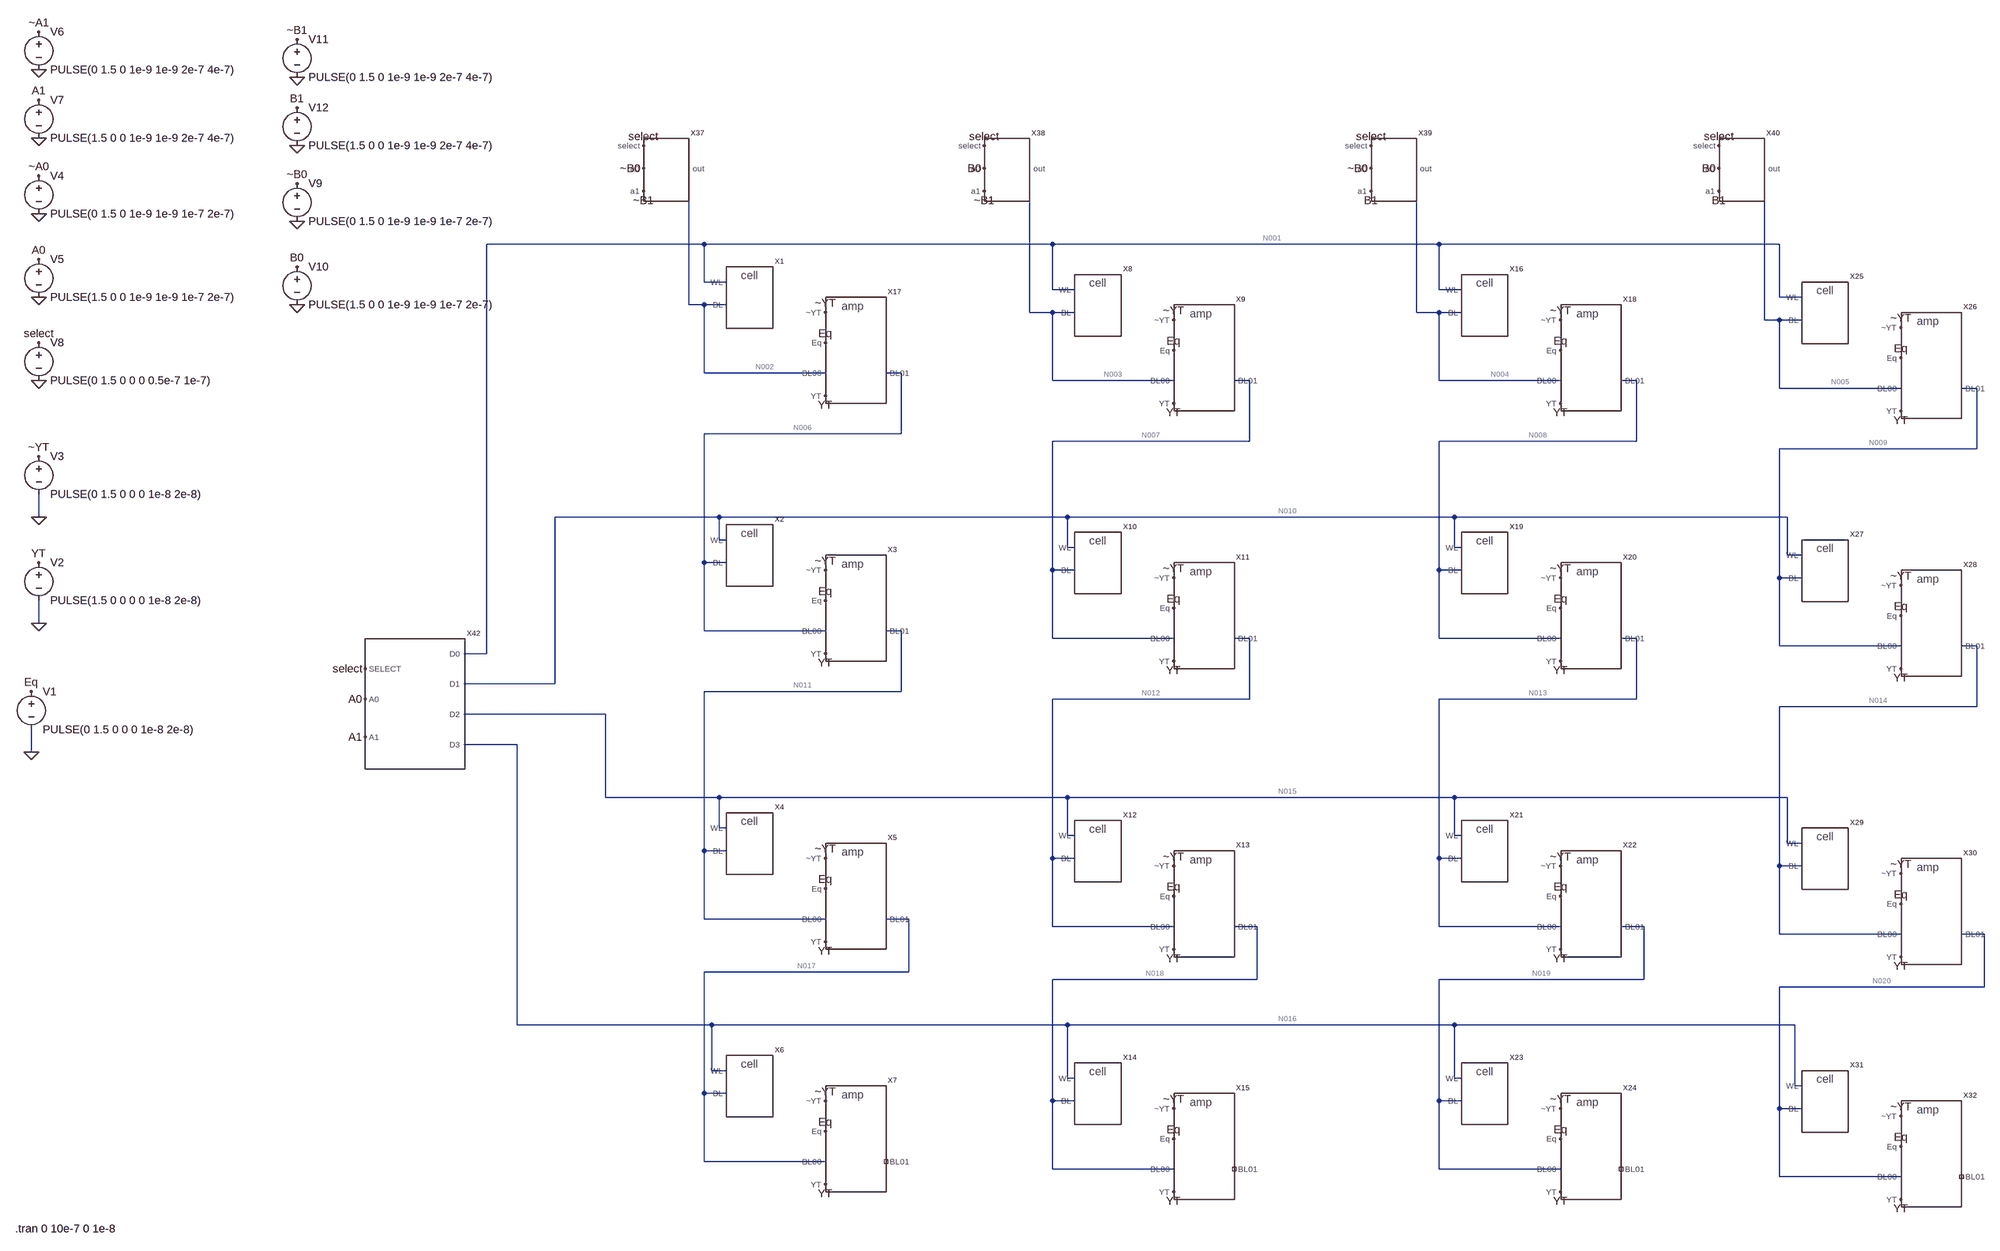
[diagram p0: schematic Memory.asc]
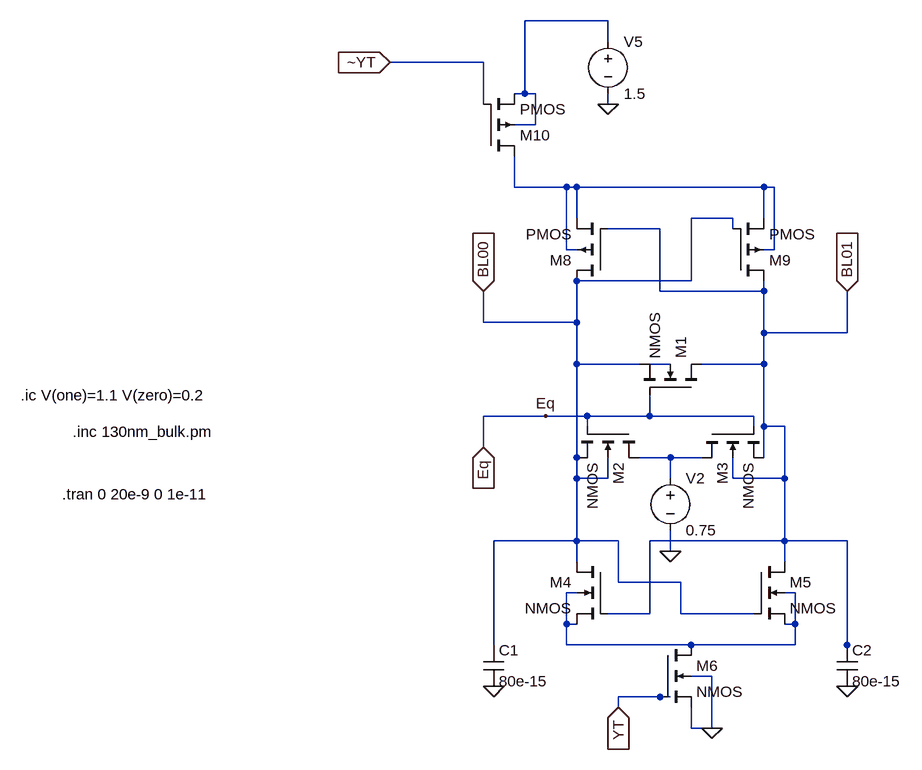
[diagram p1: sub-circuit amplifaer.asc]
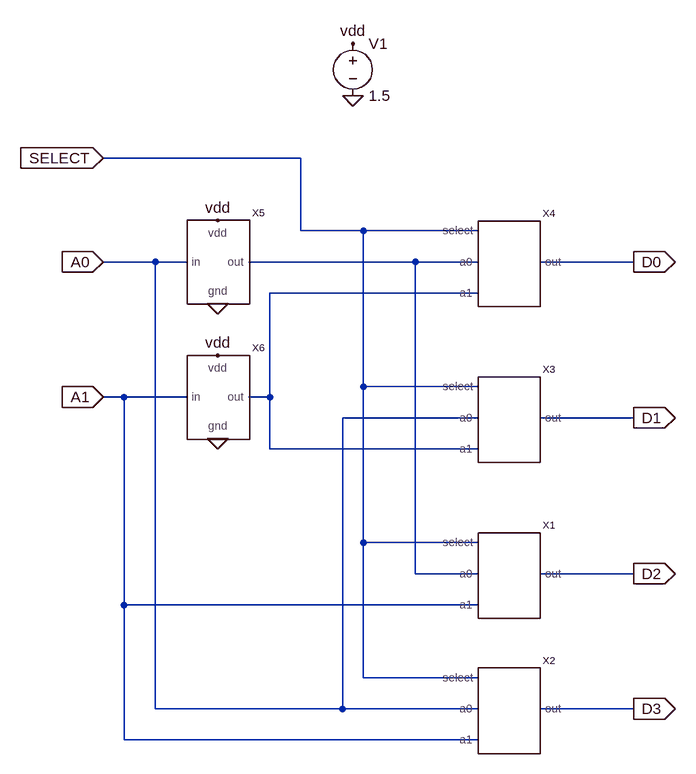
[diagram p2: sub-circuit addres_decoder.asc]
Memory.asc, the LTspice schematic file:
Version 4
SHEET 1 1716 2096
WIRE -2080 0 -2624 0
WIRE -1200 0 -2080 0
WIRE -272 0 -1200 0
WIRE 608 0 -272 0
WIRE -2080 80 -2080 0
WIRE -2032 80 -2080 80
WIRE -1200 96 -1200 0
WIRE -1152 96 -1200 96
WIRE -272 96 -272 0
WIRE -224 96 -272 96
WIRE 608 112 608 0
WIRE 656 112 608 112
WIRE -2112 128 -2112 -160
WIRE -2080 128 -2112 128
WIRE -2032 128 -2080 128
WIRE -1248 144 -1248 -160
WIRE -1200 144 -1248 144
WIRE -1152 144 -1200 144
WIRE -320 144 -320 -160
WIRE -272 144 -320 144
WIRE -224 144 -272 144
WIRE 576 160 576 -160
WIRE 608 160 576 160
WIRE 656 160 608 160
WIRE -2080 272 -2080 128
WIRE -1824 272 -2080 272
WIRE -1664 272 -1696 272
WIRE -1200 288 -1200 144
WIRE -944 288 -1200 288
WIRE -784 288 -816 288
WIRE -272 288 -272 144
WIRE -16 288 -272 288
WIRE 144 288 112 288
WIRE 608 304 608 160
WIRE 864 304 608 304
WIRE 1024 304 992 304
WIRE -1664 400 -1664 272
WIRE -1664 400 -2080 400
WIRE -784 416 -784 288
WIRE -784 416 -1200 416
WIRE 144 416 144 288
WIRE 144 416 -272 416
WIRE 1024 432 1024 304
WIRE 1024 432 608 432
WIRE -3584 576 -3584 528
WIRE -2048 576 -2480 576
WIRE -1168 576 -2048 576
WIRE -240 576 -1168 576
WIRE 624 576 -240 576
WIRE -2048 624 -2048 576
WIRE -2032 624 -2048 624
WIRE -1168 640 -1168 576
WIRE -1152 640 -1168 640
WIRE -240 640 -240 576
WIRE -224 640 -240 640
WIRE 624 656 624 576
WIRE 656 656 624 656
WIRE -2080 672 -2080 400
WIRE -2032 672 -2080 672
WIRE -1200 688 -1200 416
WIRE -1152 688 -1200 688
WIRE -272 688 -272 416
WIRE -224 688 -272 688
WIRE 608 704 608 432
WIRE 656 704 608 704
WIRE -3584 800 -3584 752
WIRE -2080 816 -2080 672
WIRE -1824 816 -2080 816
WIRE -1664 816 -1696 816
WIRE -1200 832 -1200 688
WIRE -944 832 -1200 832
WIRE -784 832 -816 832
WIRE -272 832 -272 688
WIRE -16 832 -272 832
WIRE 144 832 112 832
WIRE 608 848 608 704
WIRE 864 848 608 848
WIRE 1024 848 992 848
WIRE -2624 864 -2624 0
WIRE -2624 864 -2672 864
WIRE -2480 928 -2480 576
WIRE -2480 928 -2672 928
WIRE -1664 944 -1664 816
WIRE -1664 944 -2080 944
WIRE -784 960 -784 832
WIRE -784 960 -1200 960
WIRE 144 960 144 832
WIRE 144 960 -272 960
WIRE 1024 976 1024 848
WIRE 1024 976 608 976
WIRE -2288 992 -2672 992
WIRE -2560 1056 -2672 1056
WIRE -3600 1072 -3600 1024
WIRE -2288 1168 -2288 992
WIRE -2048 1168 -2288 1168
WIRE -1168 1168 -2048 1168
WIRE -240 1168 -1168 1168
WIRE 624 1168 -240 1168
WIRE -2048 1232 -2048 1168
WIRE -2032 1232 -2048 1232
WIRE -1168 1248 -1168 1168
WIRE -1152 1248 -1168 1248
WIRE -240 1248 -240 1168
WIRE -224 1248 -240 1248
WIRE 624 1264 624 1168
WIRE 656 1264 624 1264
WIRE -2080 1280 -2080 944
WIRE -2032 1280 -2080 1280
WIRE -1200 1296 -1200 960
WIRE -1152 1296 -1200 1296
WIRE -272 1296 -272 960
WIRE -224 1296 -272 1296
WIRE 608 1312 608 976
WIRE 656 1312 608 1312
WIRE -2080 1424 -2080 1280
WIRE -1824 1424 -2080 1424
WIRE -1648 1424 -1696 1424
WIRE -1200 1440 -1200 1296
WIRE -944 1440 -1200 1440
WIRE -768 1440 -816 1440
WIRE -272 1440 -272 1296
WIRE -16 1440 -272 1440
WIRE 160 1440 112 1440
WIRE 608 1456 608 1312
WIRE 864 1456 608 1456
WIRE 1040 1456 992 1456
WIRE -1648 1536 -1648 1424
WIRE -1648 1536 -2080 1536
WIRE -768 1552 -768 1440
WIRE -768 1552 -1200 1552
WIRE 160 1552 160 1440
WIRE 160 1552 -272 1552
WIRE 1040 1568 1040 1456
WIRE 1040 1568 608 1568
WIRE -2560 1648 -2560 1056
WIRE -2064 1648 -2560 1648
WIRE -1168 1648 -2064 1648
WIRE -240 1648 -1168 1648
WIRE 640 1648 -240 1648
WIRE -2064 1744 -2064 1648
WIRE -2032 1744 -2064 1744
WIRE -1168 1760 -1168 1648
WIRE -1152 1760 -1168 1760
WIRE -240 1760 -240 1648
WIRE -224 1760 -240 1760
WIRE 640 1776 640 1648
WIRE 656 1776 640 1776
WIRE -2080 1792 -2080 1536
WIRE -2032 1792 -2080 1792
WIRE -1200 1808 -1200 1552
WIRE -1152 1808 -1200 1808
WIRE -272 1808 -272 1552
WIRE -224 1808 -272 1808
WIRE 608 1824 608 1568
WIRE 656 1824 608 1824
WIRE -2080 1936 -2080 1792
WIRE -1824 1936 -2080 1936
WIRE -1200 1952 -1200 1808
WIRE -944 1952 -1200 1952
WIRE -272 1952 -272 1808
WIRE -16 1952 -272 1952
WIRE 608 1968 608 1824
WIRE 864 1968 608 1968
FLAG -3600 1072 0
FLAG -3600 944 Eq
FLAG -1824 1872 Eq
FLAG -1824 1360 Eq
FLAG -1824 752 Eq
FLAG -1824 208 Eq
FLAG -944 224 Eq
FLAG -944 768 Eq
FLAG -944 1376 Eq
FLAG -944 1888 Eq
FLAG -16 1888 Eq
FLAG -16 1376 Eq
FLAG -16 768 Eq
FLAG 864 784 Eq
FLAG 864 1392 Eq
FLAG 864 1904 Eq
FLAG -16 224 Eq
FLAG 864 240 Eq
FLAG -3584 800 0
FLAG -3584 672 YT
FLAG -3584 576 0
FLAG -3584 448 ~YT
FLAG -1824 320 YT
FLAG -1824 864 YT
FLAG -1824 1472 YT
FLAG -944 1488 YT
FLAG -944 880 YT
FLAG -944 336 YT
FLAG -16 336 YT
FLAG -16 880 YT
FLAG -16 1488 YT
FLAG -1824 1984 YT
FLAG -944 2000 YT
FLAG -16 2000 YT
FLAG 864 352 YT
FLAG 864 896 YT
FLAG 864 1504 YT
FLAG 864 2016 YT
FLAG -1824 144 ~YT
FLAG -944 160 ~YT
FLAG -16 160 ~YT
FLAG 864 176 ~YT
FLAG -1824 688 ~YT
FLAG -944 704 ~YT
FLAG -1824 1808 ~YT
FLAG -944 1824 ~YT
FLAG -16 1824 ~YT
FLAG 864 1840 ~YT
FLAG -1824 1296 ~YT
FLAG -944 1312 ~YT
FLAG -16 1312 ~YT
FLAG 864 1328 ~YT
FLAG -16 704 ~YT
FLAG 864 720 ~YT
FLAG -3584 112 0
FLAG -3584 -64 0
FLAG -3584 -224 0
FLAG -3584 -368 0
FLAG -3584 -448 ~A1
FLAG -3584 -304 A1
FLAG -2880 1040 A1
FLAG -3584 32 A0
FLAG -2880 960 A0
FLAG -3584 -144 ~A0
FLAG -3584 288 0
FLAG -3584 208 select
FLAG -2880 896 select
FLAG -3024 128 0
FLAG -3024 -48 0
FLAG -3024 -208 0
FLAG -3024 -352 0
FLAG -3024 -432 ~B1
FLAG -3024 -288 B1
FLAG -3024 48 B0
FLAG -3024 -128 ~B0
FLAG -2208 -160 ~B0
FLAG -416 -160 ~B0
FLAG -1344 -160 B0
FLAG 480 -160 B0
FLAG -2208 -112 ~B1
FLAG -1344 -112 ~B1
FLAG -416 -112 B1
FLAG 480 -112 B1
FLAG -2208 -208 select
FLAG -1344 -208 select
FLAG -416 -208 select
FLAG 480 -208 select
SYMBOL memory_cell -1952 112 R0
SYMATTR InstName X1
SYMBOL amplifaer -1712 176 R0
SYMATTR InstName X17
SYMBOL memory_cell -1952 656 R0
SYMATTR InstName X2
SYMBOL amplifaer -1712 720 R0
SYMATTR InstName X3
SYMBOL memory_cell -1952 1264 R0
SYMATTR InstName X4
SYMBOL amplifaer -1712 1328 R0
SYMATTR InstName X5
SYMBOL memory_cell -1952 1776 R0
SYMATTR InstName X6
SYMBOL amplifaer -1712 1840 R0
SYMATTR InstName X7
SYMBOL memory_cell -1072 128 R0
SYMATTR InstName X8
SYMBOL amplifaer -832 192 R0
SYMATTR InstName X9
SYMBOL memory_cell -1072 672 R0
SYMATTR InstName X10
SYMBOL amplifaer -832 736 R0
SYMATTR InstName X11
SYMBOL memory_cell -1072 1280 R0
SYMATTR InstName X12
SYMBOL amplifaer -832 1344 R0
SYMATTR InstName X13
SYMBOL memory_cell -1072 1792 R0
SYMATTR InstName X14
SYMBOL amplifaer -832 1856 R0
SYMATTR InstName X15
SYMBOL memory_cell -144 128 R0
SYMATTR InstName X16
SYMBOL amplifaer 96 192 R0
SYMATTR InstName X18
SYMBOL memory_cell -144 672 R0
SYMATTR InstName X19
SYMBOL amplifaer 96 736 R0
SYMATTR InstName X20
SYMBOL memory_cell -144 1280 R0
SYMATTR InstName X21
SYMBOL amplifaer 96 1344 R0
SYMATTR InstName X22
SYMBOL memory_cell -144 1792 R0
SYMATTR InstName X23
SYMBOL amplifaer 96 1856 R0
SYMATTR InstName X24
SYMBOL memory_cell 736 144 R0
SYMATTR InstName X25
SYMBOL amplifaer 976 208 R0
SYMATTR InstName X26
SYMBOL memory_cell 736 688 R0
SYMATTR InstName X27
SYMBOL amplifaer 976 752 R0
SYMATTR InstName X28
SYMBOL memory_cell 736 1296 R0
SYMATTR InstName X29
SYMBOL amplifaer 976 1360 R0
SYMATTR InstName X30
SYMBOL memory_cell 736 1808 R0
SYMATTR InstName X31
SYMBOL amplifaer 976 1872 R0
SYMATTR InstName X32
SYMBOL voltage -3600 928 R0
WINDOW 123 0 0 Left 0
WINDOW 39 0 0 Left 0
SYMATTR InstName V1
SYMATTR Value PULSE(0 1.5 0 0 0 1e-8 2e-8)
SYMBOL voltage -3584 656 R0
WINDOW 123 0 0 Left 0
WINDOW 39 0 0 Left 0
SYMATTR InstName V2
SYMATTR Value PULSE(1.5 0 0 0 0 1e-8 2e-8)
SYMBOL voltage -3584 432 R0
WINDOW 123 0 0 Left 0
WINDOW 39 0 0 Left 0
SYMATTR InstName V3
SYMATTR Value PULSE(0 1.5 0 0 0 1e-8 2e-8)
SYMBOL charge_decoder -2144 -160 R0
SYMATTR InstName X37
SYMBOL charge_decoder -1280 -160 R0
SYMATTR InstName X38
SYMBOL charge_decoder -352 -160 R0
SYMATTR InstName X39
SYMBOL charge_decoder 544 -160 R0
SYMATTR InstName X40
SYMBOL voltage -3584 -160 R0
WINDOW 123 0 0 Left 0
WINDOW 39 0 0 Left 0
SYMATTR InstName V4
SYMATTR Value PULSE(0 1.5 0 1e-9 1e-9 1e-7 2e-7)
SYMBOL voltage -3584 16 R0
WINDOW 123 0 0 Left 0
WINDOW 39 0 0 Left 0
SYMATTR InstName V5
SYMATTR Value PULSE(1.5 0 0 1e-9 1e-9 1e-7 2e-7)
SYMBOL voltage -3584 -464 R0
WINDOW 123 0 0 Left 0
WINDOW 39 0 0 Left 0
SYMATTR InstName V6
SYMATTR Value PULSE(0 1.5 0 1e-9 1e-9 2e-7 4e-7)
SYMBOL voltage -3584 -320 R0
WINDOW 123 0 0 Left 0
WINDOW 39 0 0 Left 0
SYMATTR InstName V7
SYMATTR Value PULSE(1.5 0 0 1e-9 1e-9 2e-7 4e-7)
SYMBOL voltage -3584 192 R0
WINDOW 123 0 0 Left 0
WINDOW 39 0 0 Left 0
SYMATTR InstName V8
SYMATTR Value PULSE(0 1.5 0 0 0 0.5e-7 1e-7)
SYMBOL voltage -3024 -144 R0
WINDOW 123 0 0 Left 0
WINDOW 39 0 0 Left 0
SYMATTR InstName V9
SYMATTR Value PULSE(0 1.5 0 1e-9 1e-9 1e-7 2e-7)
SYMBOL voltage -3024 32 R0
WINDOW 123 0 0 Left 0
WINDOW 39 0 0 Left 0
SYMATTR InstName V10
SYMATTR Value PULSE(1.5 0 0 1e-9 1e-9 1e-7 2e-7)
SYMBOL voltage -3024 -448 R0
WINDOW 123 0 0 Left 0
WINDOW 39 0 0 Left 0
SYMATTR InstName V11
SYMATTR Value PULSE(0 1.5 0 1e-9 1e-9 2e-7 4e-7)
SYMBOL voltage -3024 -304 R0
WINDOW 123 0 0 Left 0
WINDOW 39 0 0 Left 0
SYMATTR InstName V12
SYMATTR Value PULSE(1.5 0 0 1e-9 1e-9 2e-7 4e-7)
SYMBOL Addres_decoder -2752 960 R0
SYMATTR InstName X42
TEXT -3634 2078 Left 2 !.tran 0 10e-7 0 1e-8

amplifaer.asc, the sub-circuit schematic file:
Version 4
SHEET 1 880 680
WIRE 208 -544 80 -544
WIRE 208 -512 208 -544
WIRE 16 -480 -128 -480
WIRE 80 -432 80 -544
WIRE 80 -432 64 -432
WIRE 96 -432 80 -432
WIRE 16 -416 16 -480
WIRE 208 -416 208 -432
WIRE 96 -384 96 -432
WIRE 96 -384 64 -384
WIRE 64 -288 64 -336
WIRE 144 -288 64 -288
WIRE 160 -288 144 -288
WIRE 448 -288 160 -288
WIRE 464 -288 448 -288
WIRE 160 -240 160 -288
WIRE 400 -240 336 -240
WIRE 448 -240 448 -288
WIRE 288 -224 208 -224
WIRE 400 -224 400 -240
WIRE 144 -192 144 -288
WIRE 160 -192 144 -192
WIRE 464 -192 464 -288
WIRE 464 -192 448 -192
WIRE 336 -144 336 -240
WIRE 336 -144 160 -144
WIRE 288 -128 288 -224
WIRE 448 -128 448 -144
WIRE 448 -128 288 -128
WIRE 16 -80 16 -128
WIRE 160 -80 160 -144
WIRE 160 -80 16 -80
WIRE 448 -64 448 -128
WIRE 576 -64 576 -128
WIRE 576 -64 448 -64
WIRE 160 -16 160 -80
WIRE 256 -16 160 -16
WIRE 304 -16 272 -16
WIRE 448 -16 448 -64
WIRE 448 -16 352 -16
WIRE 112 64 16 64
WIRE 176 64 112 64
WIRE 272 64 272 32
WIRE 272 64 176 64
WIRE 432 64 272 64
WIRE 176 80 176 64
WIRE 432 80 432 64
WIRE 448 80 448 -16
WIRE 480 80 448 80
WIRE 16 112 16 64
WIRE 160 128 160 -16
WIRE 304 128 256 128
WIRE 352 128 304 128
WIRE 448 128 448 80
WIRE 160 160 160 128
WIRE 208 160 208 128
WIRE 208 160 160 160
WIRE 304 160 304 128
WIRE 400 160 400 128
WIRE 480 160 480 80
WIRE 480 160 400 160
WIRE 160 256 160 160
WIRE 160 256 32 256
WIRE 224 256 160 256
WIRE 480 256 480 160
WIRE 480 256 272 256
WIRE 576 256 480 256
WIRE 304 272 304 240
WIRE 160 288 160 256
WIRE 480 288 480 256
WIRE 224 320 224 256
WIRE 320 320 224 320
WIRE 160 336 144 336
WIRE 496 336 480 336
WIRE 272 368 272 256
WIRE 272 368 208 368
WIRE 320 368 320 320
WIRE 432 368 320 368
WIRE 144 384 144 336
WIRE 160 384 144 384
WIRE 496 384 496 336
WIRE 496 384 480 384
WIRE 32 416 32 256
WIRE 144 416 144 384
WIRE 336 416 144 416
WIRE 496 416 496 384
WIRE 496 416 336 416
WIRE 576 416 576 256
WIRE 576 432 576 416
WIRE 368 464 336 464
WIRE 288 496 224 496
WIRE 304 496 288 496
WIRE 224 512 224 496
WIRE 336 544 336 512
WIRE 368 544 368 464
WIRE 368 544 336 544
FLAG 304 272 0
FLAG 576 480 0
FLAG 32 480 0
FLAG 368 544 0
FLAG 112 64 Eq
FLAG 208 -416 0
FLAG 16 112 Eq
IOPIN 16 112 In
FLAG -128 -480 ~YT
IOPIN -128 -480 In
FLAG 16 -128 BL00
IOPIN 16 -128 In
FLAG 224 512 YT
IOPIN 224 512 In
FLAG 576 -128 BL01
IOPIN 576 -128 In
SYMBOL nmos4 352 32 M270
SYMATTR InstName M1
SYMATTR Value2 l=130e-9 w=1300e-9 ad=676000e-18 as=676000e-18 pd=3640e-9 ps=3640e-9
SYMBOL nmos4 256 80 R90
SYMATTR InstName M2
SYMATTR Value2 l=130e-9 w=1300e-9 ad=676000e-18 as=676000e-18 pd=3640e-9 ps=3640e-9
SYMBOL nmos4 352 80 M90
SYMATTR InstName M3
SYMATTR Value2 l=130e-9 w=1300e-9 ad=676000e-18 as=676000e-18 pd=3640e-9 ps=3640e-9
SYMBOL voltage 304 144 R0
WINDOW 123 0 0 Left 0
WINDOW 39 0 0 Left 0
SYMATTR InstName V2
SYMATTR Value 0.75
SYMBOL cap 16 416 R0
SYMATTR InstName C1
SYMATTR Value 80e-15
SYMBOL cap 560 416 R0
SYMATTR InstName C2
SYMATTR Value 80e-15
SYMBOL nmos4 208 288 M0
SYMATTR InstName M4
SYMATTR Value2 l=130e-9 w=1300e-9 ad=676000e-18 as=676000e-18 pd=3640e-9 ps=3640e-9
SYMBOL nmos4 432 288 R0
SYMATTR InstName M5
SYMATTR Value2 l=130e-9 w=1300e-9 ad=676000e-18 as=676000e-18 pd=3640e-9 ps=3640e-9
SYMBOL nmos4 288 416 R0
SYMATTR InstName M6
SYMATTR Value2 l=130e-9 w=1300e-9 ad=676000e-18 as=676000e-18 pd=3640e-9 ps=3640e-9
SYMBOL pmos4 208 -144 R180
SYMATTR InstName M8
SYMATTR Value2 l=130e-9 w=2600e-9 ad=676000e-18 as=676000e-18 pd=3640e-9 ps=3640e-9
SYMBOL pmos4 400 -144 M180
SYMATTR InstName M9
SYMATTR Value2 l=130e-9 w=12600e-9 ad=676000e-18 as=676000e-18 pd=3640e-9 ps=3640e-9
SYMBOL pmos4 16 -336 M180
SYMATTR InstName M10
SYMATTR Value2 l=130e-9 w=2600e-9 ad=676000e-18 as=676000e-18 pd=3640e-9 ps=3640e-9
SYMBOL voltage 208 -528 R0
WINDOW 123 0 0 Left 0
WINDOW 39 0 0 Left 0
SYMATTR InstName V5
SYMATTR Value 1.5
TEXT -616 88 Left 2 !.inc 130nm_bulk.pm
TEXT -632 184 Left 2 !.tran 0 20e-9 0 1e-11
TEXT -696 32 Left 2 !.ic V(one)=1.1 V(zero)=0.2

addres_decoder.asc, the sub-circuit schematic file:
Version 4
SHEET 1 880 680
WIRE -128 -368 -432 -368
WIRE -128 -256 -128 -368
WIRE -32 -256 -128 -256
WIRE 144 -256 -32 -256
WIRE -352 -208 -432 -208
WIRE -304 -208 -352 -208
WIRE 48 -208 -208 -208
WIRE 144 -208 48 -208
WIRE 384 -208 240 -208
WIRE 144 -160 -176 -160
WIRE -32 -16 -32 -256
WIRE 144 -16 -32 -16
WIRE -400 0 -432 0
WIRE -304 0 -400 0
WIRE -176 0 -176 -160
WIRE -176 0 -208 0
WIRE 144 32 -64 32
WIRE 384 32 240 32
WIRE -176 80 -176 0
WIRE 144 80 -176 80
WIRE -32 224 -32 -16
WIRE 144 224 -32 224
WIRE 48 272 48 -208
WIRE 144 272 48 272
WIRE 384 272 240 272
WIRE -400 320 -400 0
WIRE 144 320 -400 320
WIRE -32 432 -32 224
WIRE 144 432 -32 432
WIRE -352 480 -352 -208
WIRE -64 480 -64 32
WIRE -64 480 -352 480
WIRE 144 480 -64 480
WIRE 384 480 240 480
WIRE -400 528 -400 320
WIRE 144 528 -400 528
FLAG -256 -144 0
FLAG -256 64 0
FLAG -48 -464 0
FLAG -48 -544 vdd
FLAG -256 -272 vdd
FLAG -256 -64 vdd
FLAG -432 -368 SELECT
IOPIN -432 -368 In
FLAG -432 -208 A0
IOPIN -432 -208 In
FLAG -432 0 A1
IOPIN -432 0 In
FLAG 384 -208 D0
IOPIN 384 -208 Out
FLAG 384 32 D1
IOPIN 384 32 Out
FLAG 384 272 D2
IOPIN 384 272 Out
FLAG 384 480 D3
IOPIN 384 480 Out
SYMBOL charge_decoder 208 272 R0
SYMATTR InstName X1
SYMBOL charge_decoder 208 480 R0
SYMATTR InstName X2
SYMBOL charge_decoder 208 32 R0
SYMATTR InstName X3
SYMBOL charge_decoder 208 -208 R0
SYMATTR InstName X4
SYMBOL invert -256 -208 R0
SYMATTR InstName X5
SYMBOL invert -256 0 R0
SYMATTR InstName X6
SYMBOL voltage -48 -560 R0
WINDOW 123 0 0 Left 0
WINDOW 39 0 0 Left 0
SYMATTR InstName V1
SYMATTR Value 1.5

The netlist it stands for:
* Memory.asc
XX1 N001 N002 memory_cell  ; pins WL BL
XX17 Eq YT ~YT N002 N006 amplifaer
XX2 N010 N006 memory_cell  ; pins WL BL
XX3 Eq YT ~YT N006 N011 amplifaer
XX4 N015 N011 memory_cell  ; pins WL BL
XX5 Eq YT ~YT N011 N017 amplifaer
XX6 N016 N017 memory_cell  ; pins WL BL
XX7 Eq YT ~YT N017 NC_01 amplifaer
XX8 N001 N003 memory_cell  ; pins WL BL
XX9 Eq YT ~YT N003 N007 amplifaer
XX10 N010 N007 memory_cell  ; pins WL BL
XX11 Eq YT ~YT N007 N012 amplifaer
XX12 N015 N012 memory_cell  ; pins WL BL
XX13 Eq YT ~YT N012 N018 amplifaer
XX14 N016 N018 memory_cell  ; pins WL BL
XX15 Eq YT ~YT N018 NC_02 amplifaer
XX16 N001 N004 memory_cell  ; pins WL BL
XX18 Eq YT ~YT N004 N008 amplifaer
XX19 N010 N008 memory_cell  ; pins WL BL
XX20 Eq YT ~YT N008 N013 amplifaer
XX21 N015 N013 memory_cell  ; pins WL BL
XX22 Eq YT ~YT N013 N019 amplifaer
XX23 N016 N019 memory_cell  ; pins WL BL
XX24 Eq YT ~YT N019 NC_03 amplifaer
XX25 N001 N005 memory_cell  ; pins WL BL
XX26 Eq YT ~YT N005 N009 amplifaer
XX27 N010 N009 memory_cell  ; pins WL BL
XX28 Eq YT ~YT N009 N014 amplifaer
XX29 N015 N014 memory_cell  ; pins WL BL
XX30 Eq YT ~YT N014 N020 amplifaer
XX31 N016 N020 memory_cell  ; pins WL BL
XX32 Eq YT ~YT N020 NC_04 amplifaer
V1 Eq 0 PULSE(0 1.5 0 0 0 1e-8 2e-8)
V2 YT 0 PULSE(1.5 0 0 0 0 1e-8 2e-8)
V3 ~YT 0 PULSE(0 1.5 0 0 0 1e-8 2e-8)
XX37 select ~B0 ~B1 N002 charge_decoder  ; pins select a0 a1 out
XX38 select B0 ~B1 N003 charge_decoder  ; pins select a0 a1 out
XX39 select ~B0 B1 N004 charge_decoder  ; pins select a0 a1 out
XX40 select B0 B1 N005 charge_decoder  ; pins select a0 a1 out
V4 ~A0 0 PULSE(0 1.5 0 1e-9 1e-9 1e-7 2e-7)
V5 A0 0 PULSE(1.5 0 0 1e-9 1e-9 1e-7 2e-7)
V6 ~A1 0 PULSE(0 1.5 0 1e-9 1e-9 2e-7 4e-7)
V7 A1 0 PULSE(1.5 0 0 1e-9 1e-9 2e-7 4e-7)
V8 select 0 PULSE(0 1.5 0 0 0 0.5e-7 1e-7)
V9 ~B0 0 PULSE(0 1.5 0 1e-9 1e-9 1e-7 2e-7)
V10 B0 0 PULSE(1.5 0 0 1e-9 1e-9 1e-7 2e-7)
V11 ~B1 0 PULSE(0 1.5 0 1e-9 1e-9 2e-7 4e-7)
V12 B1 0 PULSE(1.5 0 0 1e-9 1e-9 2e-7 4e-7)
XX42 select A0 A1 N001 N010 N015 N016 addres_decoder

* block symbol definitions
.subckt amplifaer Eq YT ~YT BL00 BL01
M1 BL01 Eq BL00 N003 NMOS l=130e-9 w=1300e-9 ad=676000e-18 as=676000e-18 pd=3640e-9 ps=3640e-9
M2 N004 Eq BL00 BL00 NMOS l=130e-9 w=1300e-9 ad=676000e-18 as=676000e-18 pd=3640e-9 ps=3640e-9
M3 N004 Eq BL01 BL01 NMOS l=130e-9 w=1300e-9 ad=676000e-18 as=676000e-18 pd=3640e-9 ps=3640e-9
V2 N004 0 0.75
C1 BL00 0 80e-15
C2 BL01 0 80e-15
M4 BL00 BL01 N005 N005 NMOS l=130e-9 w=1300e-9 ad=676000e-18 as=676000e-18 pd=3640e-9 ps=3640e-9
M5 BL01 BL00 N005 N005 NMOS l=130e-9 w=1300e-9 ad=676000e-18 as=676000e-18 pd=3640e-9 ps=3640e-9
M6 N005 YT 0 0 NMOS l=130e-9 w=1300e-9 ad=676000e-18 as=676000e-18 pd=3640e-9 ps=3640e-9
M8 BL00 BL01 N002 N002 PMOS l=130e-9 w=2600e-9 ad=676000e-18 as=676000e-18 pd=3640e-9 ps=3640e-9
M9 BL01 BL00 N002 N002 PMOS l=130e-9 w=12600e-9 ad=676000e-18 as=676000e-18 pd=3640e-9 ps=3640e-9
M10 N002 ~YT N001 N001 PMOS l=130e-9 w=2600e-9 ad=676000e-18 as=676000e-18 pd=3640e-9 ps=3640e-9
V5 N001 0 1.5
.inc 130nm_bulk.pm
.tran 0 20e-9 0 1e-11
.ic V(one)=1.1 V(zero)=0.2
.ends amplifaer

.subckt addres_decoder SELECT A0 A1 D0 D1 D2 D3
XX1 SELECT N001 A1 D2 charge_decoder  ; pins select a0 a1 out
XX2 SELECT A0 A1 D3 charge_decoder  ; pins select a0 a1 out
XX3 SELECT A0 N002 D1 charge_decoder  ; pins select a0 a1 out
XX4 SELECT N001 N002 D0 charge_decoder  ; pins select a0 a1 out
XX5 A0 vdd 0 N001 invert  ; pins in vdd gnd out
XX6 A1 vdd 0 N002 invert  ; pins in vdd gnd out
V1 vdd 0 1.5
.ends addres_decoder

.model NMOS NMOS
.model PMOS PMOS
.lib standard.mos
.tran 0 10e-7 0 1e-8
.backanno
.end

* Results of the author's LTspice run, read from the files saved beside the schematic
* Operating Point, zero values left out:
*   V(n002) = 163 µV
*   V(n001) = 24.55 µV
*   V(n006) = 1.444 V
*   V(yt) = 1.5 V
*   V(n010) = 28.44 µV
*   V(n011) = 613 µV
*   V(n015) = 24.55 µV
*   V(n017) = 1.444 V
*   V(n016) = 28.44 µV
*   V(n003) = 163 µV
*   V(n007) = 1.444 V
*   V(n012) = 613 µV
*   V(n018) = 1.444 V
*   V(n004) = 163 µV
*   V(n008) = 1.444 V
*   V(n013) = 613 µV
*   V(n019) = 1.444 V
*   V(n005) = 163 µV
*   V(n009) = 1.444 V
*   V(n014) = 613 µV
*   V(n020) = 1.444 V
*   V(b0) = 1.5 V
*   V(b1) = 1.5 V
*   V(a0) = 1.5 V
*   V(a1) = 1.5 V
*   I(V11) = 11.94 nA
*   I(V10) = -4.489 nA
*   I(V9) = 4.587 nA
*   I(V8) = 6.68 nA
*   I(V7) = -27.71 nA
*   I(V5) = -32.2 nA
*   I(V3) = 2.008 nA
*   I(V2) = -443.2 nA
*   I(V1) = 139.4 nA
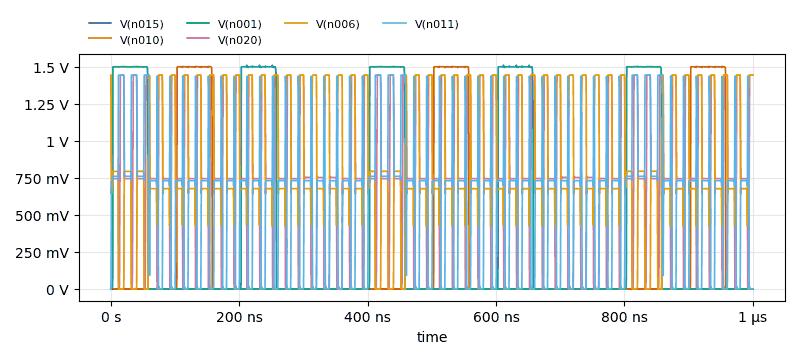
[diagram p3: Transient Analysis of Memory.asc, plotted from the saved traces]
* Transient Analysis, 1 run:
*   V(n015): min -1.038 mV, max 1.51 V, average 163.7 mV, rms 495 mV, last 24.42 µV
*   V(n010): min -1.648 mV, max 1.503 V, average 245.8 mV, rms 606.6 mV, last 28.93 µV
*   V(n001): min -730.7 µV, max 1.502 V, average 245.8 mV, rms 606.6 mV, last 24.34 µV
*   V(n020): min -4.069 mV, max 1.444 V, average 820 mV, rms 934.1 mV, last 1.444 V
*   V(n006): min -3.816 mV, max 1.444 V, average 880.7 mV, rms 974.1 mV, last 1.444 V
*   V(n011): min -3.875 mV, max 1.45 V, average 627.5 mV, rms 767.9 mV, last 607.8 µV